# EAGLE schematic 388 Design Project Schematic (EAGLE 9.2.2)
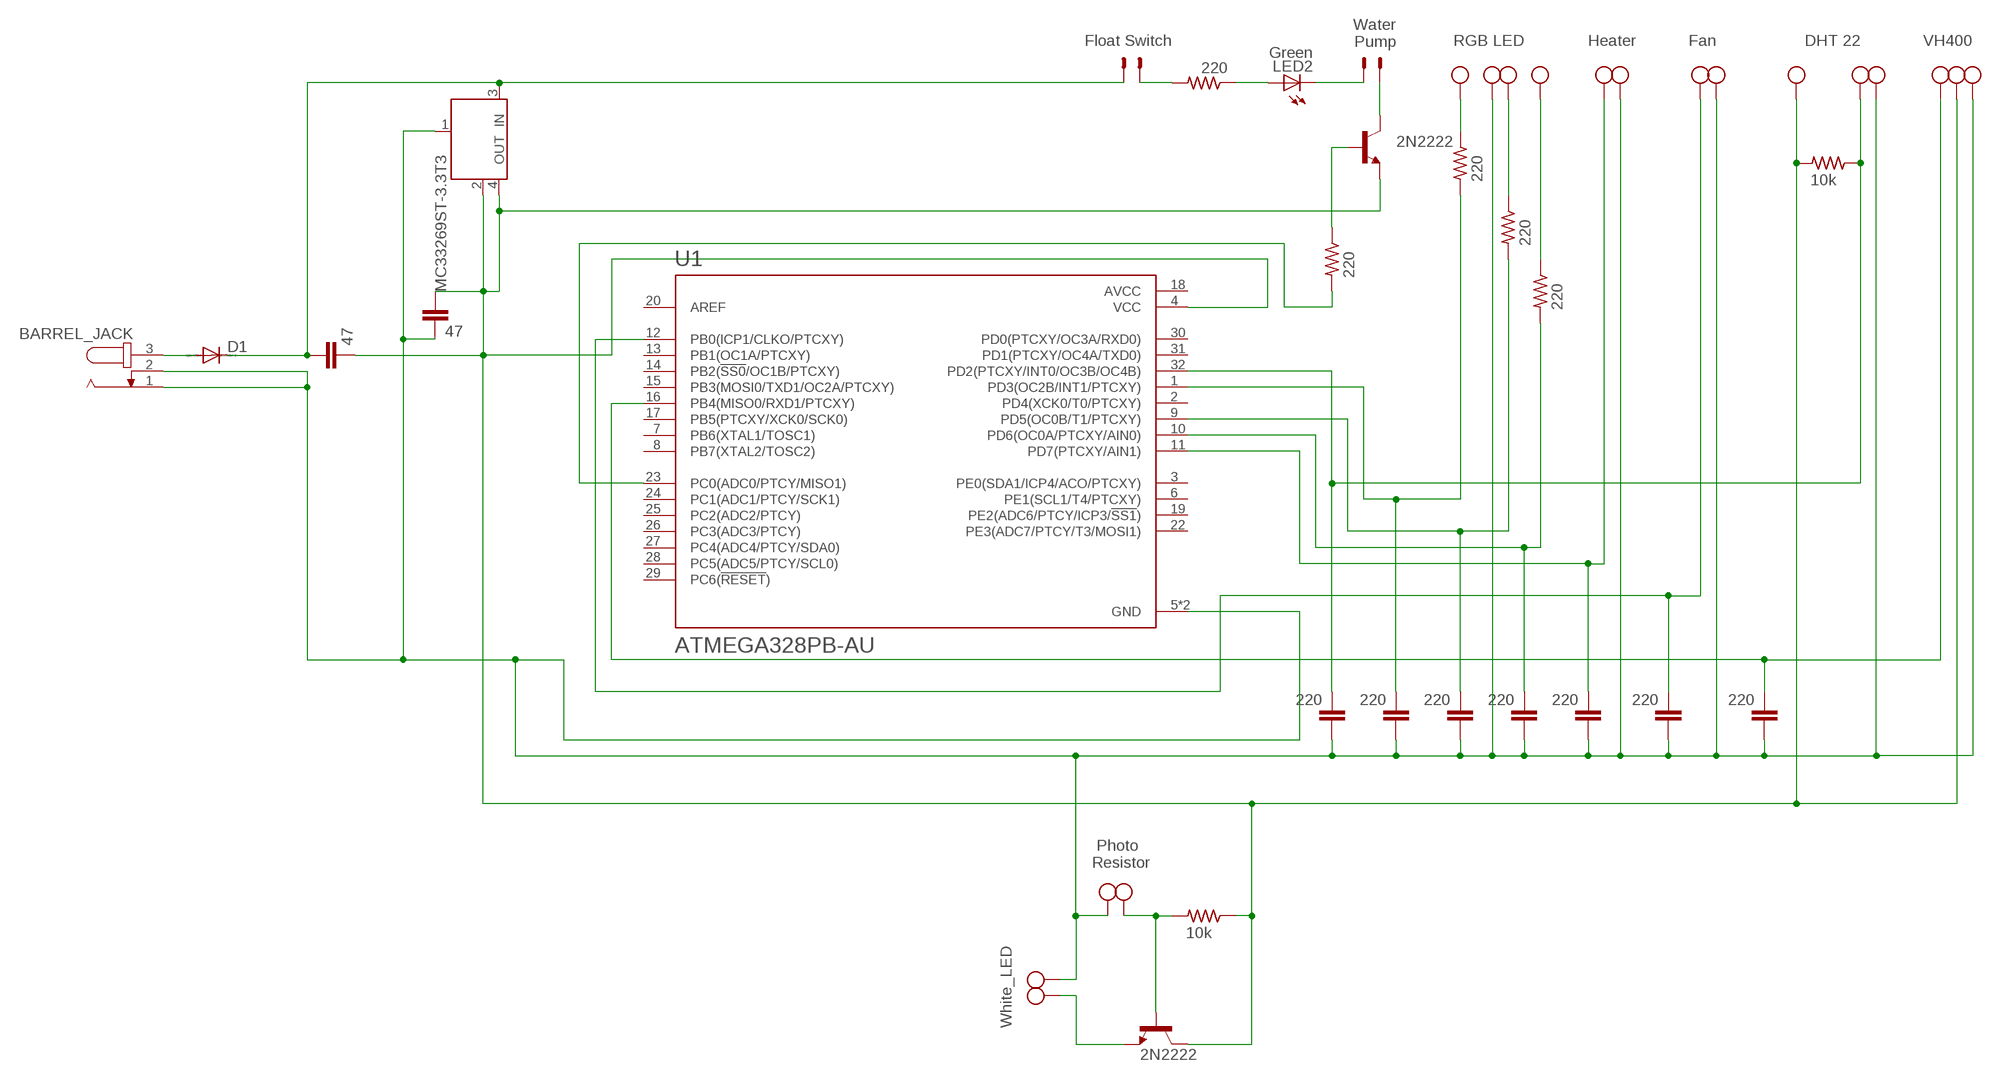
[diagram p0: schematic, sheet 1]

## Parts
BARREL_JACK  JACK-PLUG1  [SPC4078]
C2  220  C-EU025-024X044  [C025-024X044]
C4  220  C-EU025-024X044  [C025-024X044]
C5  220  C-EU025-024X044  [C025-024X044]
C6  220  C-EU025-024X044  [C025-024X044]
C7  220  C-EU025-024X044  [C025-024X044]
C8  47  C-EU025-024X044  [C025-024X044]
C9  47  C-EU025-024X044  [C025-024X044]
C10  220  C-EU025-024X044  [C025-024X044]
C11  220  C-EU025-024X044  [C025-024X044]
D1  DIODE-DO214BA  [DO214BA]
IC1  MC33269ST-3.3T3  [SOT223]
LED2  Green  LEDCHIPLED_0805  [CHIPLED_0805]
R1  220  R-US_R0805  [R0805]
R2  220  R-US_R0805  [R0805]
R3  10k  R-US_R0805  [R0805]
R4  220  R-US_R0805  [R0805]
R6  220  R-US_R0805  [R0805]
R7  220  R-US_R0805  [R0805]
R8  10k  R-US_R0805  [R0805]
T1  2N2222  [TO18]
T2  2N2222  [TO18]
U1  ATMEGA328PB-AU  [QFP80P900X900X120-32N]
WHITE_LED  AK300/2  [AK300/2]
X1  1X02_5MM_SCREW  [W237-102]
X2  AK300/2  [AK300/2]
X4  1X02_5MM_SCREW  [W237-102]
X5  AK300/3  [AK300/3]
X6  AK300/4  [AK300/4]
X7  AK300/3  [AK300/3]
X8  1X02_5MM_SCREW  [W237-102]
X9  332-02  [332-02]
X10  332-02  [332-02]

## Nets
N$1: BARREL_JACK.3 D1.A
N$2: R2.1 X6.4
N$3: T2.1(E) WHITE_LED.1
N$4: R3.2 T2.2(B) X2.2
N$5: R4.2 U1.23(PC0(ADC0/PTCY/MISO1))
N$6: BARREL_JACK.1 BARREL_JACK.2 C2.1 C4.1 C5.1 C6.1 C7.1 C9.2 C10.1 C11.1 IC1.1(GND/ADJ) U1.5(GND) U1.21(GND) WHITE_LED.2 X1.2 X2.1 X4.1 X6.3 X7.1 X8.1
N$7: C8.2 C9.1 IC1.2(OUT) IC1.4(OUT) R3.1 R8.2 T1.1(E) T2.3(C) U1.4(VCC) X5.3 X7.2
N$8: C11.2 U1.16(PB4(MISO0/RXD1/PTCXY)) X7.3
N$9: C7.2 R2.2 U1.1(PD3(OC2B/INT1/PTCXY))
N$10: C10.2 U1.12(PB0(ICP1/CLKO/PTCXY)) X8.2
N$11: R4.1 T1.2(B)
N$12: C5.2 R7.2 U1.10(PD6(OC0A/PTCXY/AIN0))
N$13: C4.2 R6.2 U1.9(PD5(OC0B/T1/PTCXY))
N$14: R6.1 X6.2
N$15: R7.1 X6.1
N$16: LED2.C X9.1
N$17: T1.3(C) X9.2
N$19: LED2.A R1.1
N$21: R1.2 X10.1
N$22: C8.1 D1.C IC1.3(IN) X10.2
N$25: C6.2 R8.1 U1.32(PD2(PTCXY/INT0/OC3B/OC4B)) X1.1
N$26: C2.2 U1.11(PD7(PTCXY/AIN1)) X4.2
Unconnected: U1.2(PD4(XCK0/T0/PTCXY)) U1.3(PE0(SDA1/ICP4/ACO/PTCXY)) U1.6(PE1(SCL1/T4/PTCXY)) U1.7(PB6(XTAL1/TOSC1)) U1.8(PB7(XTAL2/TOSC2)) U1.13(PB1(OC1A/PTCXY)) U1.14(PB2(!SS0!/OC1B/PTCXY)) U1.15(PB3(MOSI0/TXD1/OC2A/PTCXY)) U1.17(PB5(PTCXY/XCK0/SCK0)) U1.19(PE2(ADC6/PTCY/ICP3/!SS1!)) U1.20(AREF) U1.22(PE3(ADC7/PTCY/T3/MOSI1)) U1.24(PC1(ADC1/PTCY/SCK1)) U1.25(PC2(ADC2/PTCY)) U1.26(PC3(ADC3/PTCY)) U1.27(PC4(ADC4/PTCY/SDA0)) U1.28(PC5(ADC5/PTCY/SCL0)) U1.29(PC6(!RESET!)) U1.30(PD0(PTCXY/OC3A/RXD0)) U1.31(PD1(PTCXY/OC4A/TXD0)) X5.1 X5.2

## Notes on the sheet
- Water
  Pump
- Float Switch | RGB LED | Heater | Fan | DHT 22 | VH400
- Photo
  Resistor
- White_LED

## Power pins joined to a net without a drawn wire
AVCC: U1.18(AVCC)

## Library data of the parts
BARREL_JACK = con-jack:JACK-PLUG: DC POWER JACK Power Jack, DC, Right Angle, Through Hole, Rated 5A at 16VDC, PC Terminals Distributor: Farnell (www.Farnell.de) Drawing: 84N1161.pdf / 84N1162.pdf Manufacturer: SPC Technology (www.spctechnology.com) Type: SPC4077 / SPC 4078; OC_FARNELL: unknown; OC_NEWARK: unknown
C2 C4-C11 = rcl:C-EU: CAPACITOR, European symbol; SPICEPREFIX: C
D1 = diode:DIODE-: DIODE
IC1 = linear:MC33269ST*: Adjustable Output Low Dropout Voltage Regulator 800 mA Source: http://www.onsemi.com/pub/Collateral/MC33269-D.PDF
LED2 = led:LED: LED OSRAM: - CHIPLED LG R971, LG N971, LY N971, LG Q971, LY Q971, LO R971, LY R971 LH N974, LH R974 LS Q976, LO Q976, LY Q976 LO Q996 - Hyper CHIPLED LW Q18S LB Q993, LB Q99A, LB R99A - SideLED LS A670, LO A670, LY A670, LG A670, LP A670 LB A673, LV A673, LT A673, LW A673 LH A674 LY A675 LS A676, LA A676, LO A676, LY A676, LW A676 LS A679, LY A679, LG A679 - Hyper Micro SIDELED® LS Y876, LA Y876, LO Y876, LY Y876 LT Y87S - SmartLED LW L88C, LW L88S LB L89C, LB L89S, LG L890 LS L89K, LO L89K, LY L89K LS L896, LA L896, LO L896, LY L896 - TOPLED LS T670, LO T670, LY T670, LG T670, LP T670 LSG T670, LSP T670, LSY T670, LOP T670, LYG T670 LG T671, LOG T671, LSG T671 LB T673, LV T673, LT T673, LW T673 LH T674 LS T676, LA T676, LO T676, LY T676, LB T676, LH T676, LSB T676, LW T676 LB T67C, LV T67C, LT T67C, LS T67K, LO T67K, LY T67K, LW E67C LS E67B, LA E67B, LO E67B, LY E67B, LB E67C, LV E67C, LT E67C LW T67C LS T679, LY T679, LG T679 LS T770, LO T770, LY T770, LG T770, LP T770 LB T773, LV T773, LT T773, LW T773 LH T774 LS E675, LA E675, LY E675, LS T675 LS T776, LA T776, LO T776, LY T776, LB T776 LHGB T686 LT T68C, LB T68C - Hyper Mini TOPLED® LB M676 - Mini TOPLED Santana® LG M470 LS M47K, LO M47K, LY M47K Source: http://www.osram.convergy.de LUXEON: - LUMILED® LXK2-PW12-R00, LXK2-PW12-S00, LXK2-PW14-U00, LXK2-PW14-V00 LXK2-PM12-R00, LXK2-PM12-S00, LXK2-PM14-U00 LXK2-PE12-Q00, LXK2-PE12-R00, LXK2-PE12-S00, LXK2-PE14-T00, LXK2-PE14-U00 LXK2-PB12-K00, LXK2-PB12-L00, LXK2-PB12-M00, LXK2-PB14-N00, LXK2-PB14-P00, LXK2-PB14-Q00 LXK2-PR12-L00, LXK2-PR12-M00, LXK2-PR14-Q00, LXK2-PR14-R00 LXK2-PD12-Q00, LXK2-PD12-R00, LXK2-PD12-S00 LXK2-PH12-R00, LXK2-PH12-S00 LXK2-PL12-P00, LXK2-PL12-Q00, LXK2-PL12-R00 Source: www.luxeon.com KINGBRIGHT: KA-3528ASYC Source: www.kingbright.com
R1-R4 R6-R8 = rcl:R-US_: RESISTOR, American symbol; SPICEPREFIX: R
T1 T2 = transistor-neu-to92:2N2222: NPN TRANSISTOR
U1 = ATMEGA328PB-AU:ATMEGA328PB-AU: ATmega Series 20 MHz 32 KB Flash 2 KB SRAM 8-Bit Microcontroller - TQFP-32; AVAILABILITY: Unavailable; DESCRIPTION: AVR microcontroller; EEPROM: 1024B; SRAM: 2kB; Flash: 32kB; TQFP32; MF: Microchip; MP: ATMEGA328PB-AU; PACKAGE: TQFP-32 Microchip; PRICE: None
WHITE_LED X2 = con-ptr500:AK300/2: CONNECTOR; OC_FARNELL: unknown; OC_NEWARK: unknown
X1 X4 X8 = ECE388:1X02_5MM_SCREW: WAGO SCREW CLAMP; MPN: 237-102; OC_FARNELL: unknown; OC_NEWARK: 70K9898
X5 X7 = con-ptr500:AK300/3: CONNECTOR; OC_FARNELL: unknown; OC_NEWARK: unknown
X6 = con-ptr500:AK300/4: CONNECTOR; OC_FARNELL: unknown; OC_NEWARK: unknown
X9 X10 = con-garry:332-02: 2 Pin - 2mm Dual Row Source: www.mpe-connector.de / garry_shortform_2012.pdf